# EAGLE design Lamp Segment (EAGLE 8.2.0)
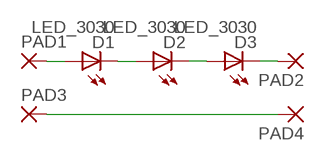
[diagram p0: schematic, sheet 1]

## Parts
D1  LED_3030  [LED3030]
D2  LED_3030  [LED3030]
D3  LED_3030  [LED3030]
PAD1  SMD5  [SMD2,54-5,08]
PAD2  SMD5  [SMD2,54-5,08]
PAD3  SMD5  [SMD2,54-5,08]
PAD4  SMD5  [SMD2,54-5,08]

## Nets
1: D1.P$1(A) PAD1.1(P)
2: D1.P$2(C) D2.P$1(A)
3: D2.P$2(C) D3.P$1(A)
4: D3.P$2(C) PAD2.1(P)
BP: PAD3.1(P) PAD4.1(P)

## Library data of the parts
D1-D3 = Namenlos:LED_
PAD1-PAD4 = wirepad:SMD5: SMD PAD

## Board
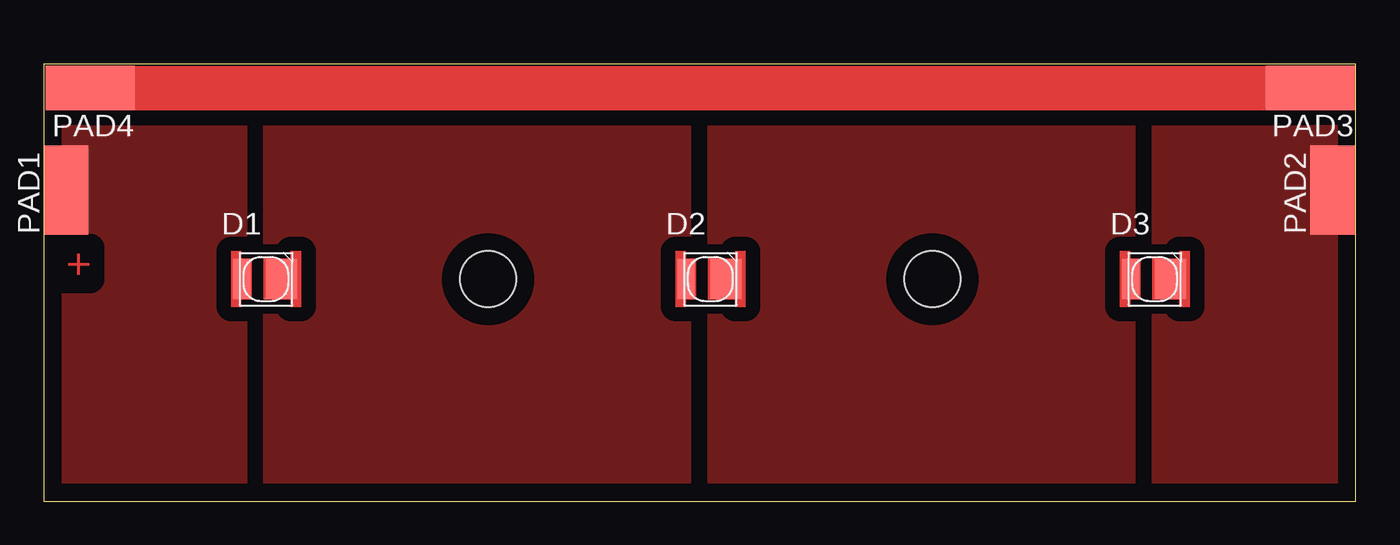
[diagram p1: board, top side]

Size 75 x 25 mm. Coordinates in mm from the lower left corner, seen from the top.
Outline: 0,0 25.4,0 75,0 75,25 0,25 0,0
Copper layers (1*16): Top 0.035mm / dielectric 1.5mm / Bottom 0.035mm
Design rules "default": minimum track width 6mil, minimum drill 0.35mm, track to track 6mil, track to pad 6mil, pad to pad 6mil, via to via 6mil, smd to smd 6mil, copper to edge 40mil, drill to drill 6mil, minimum pad ring 10mil, minimum via ring 8mil, stop-mask expansion 4mil, vias tented up to drill 0mil, thermal gap 10mil
Holes 3.2 mm at 25.4,12.7 50.8,12.7

### Footprints (pad centres in the part's own frame; a part is rotated, then mirrored left to right if it is on the bottom)
LED3030 = smd 0.965 x 2.27: P$1 -1.393,0 | smd 1.786 x 2.27: P$2 0.897,0
SMD2,54-5,08 = smd 2.54 x 5.08: 1 0,0

### Placement (x,y rotation side)
D1  12.7,12.7 0 top
D2  38.1,12.7 0 top
D3  63.5,12.7 0 top
PAD1  1.27,17.78 0 top
PAD2  73.66,17.78 0 top
PAD3  72.39,23.62 90 top
PAD4  2.67,23.62 90 top

### Tracks (layer width: path | path; a pad name or v marks a point on that pad's centre or on a via)
1
  pour Top (isolate 0.813, no thermals): 0,21.59 11.43,21.59 11.43,0 0,0
2
  pour Top (isolate 0.813, no thermals): 12.7,21.59 12.7,0 36.83,0 36.83,21.59
3
  pour Top (isolate 0.813, no thermals): 38.1,21.59 38.1,0 62.23,0 62.23,21.59
4
  pour Top (isolate 0.813, no thermals): 63.5,21.59 63.5,0 74.93,0 74.93,21.59
BP
  Top 2.54: PAD4.1 PAD3.1

### Text on the board
Top: +